# Altium schematic sheet Main.SchDoc
size Legal
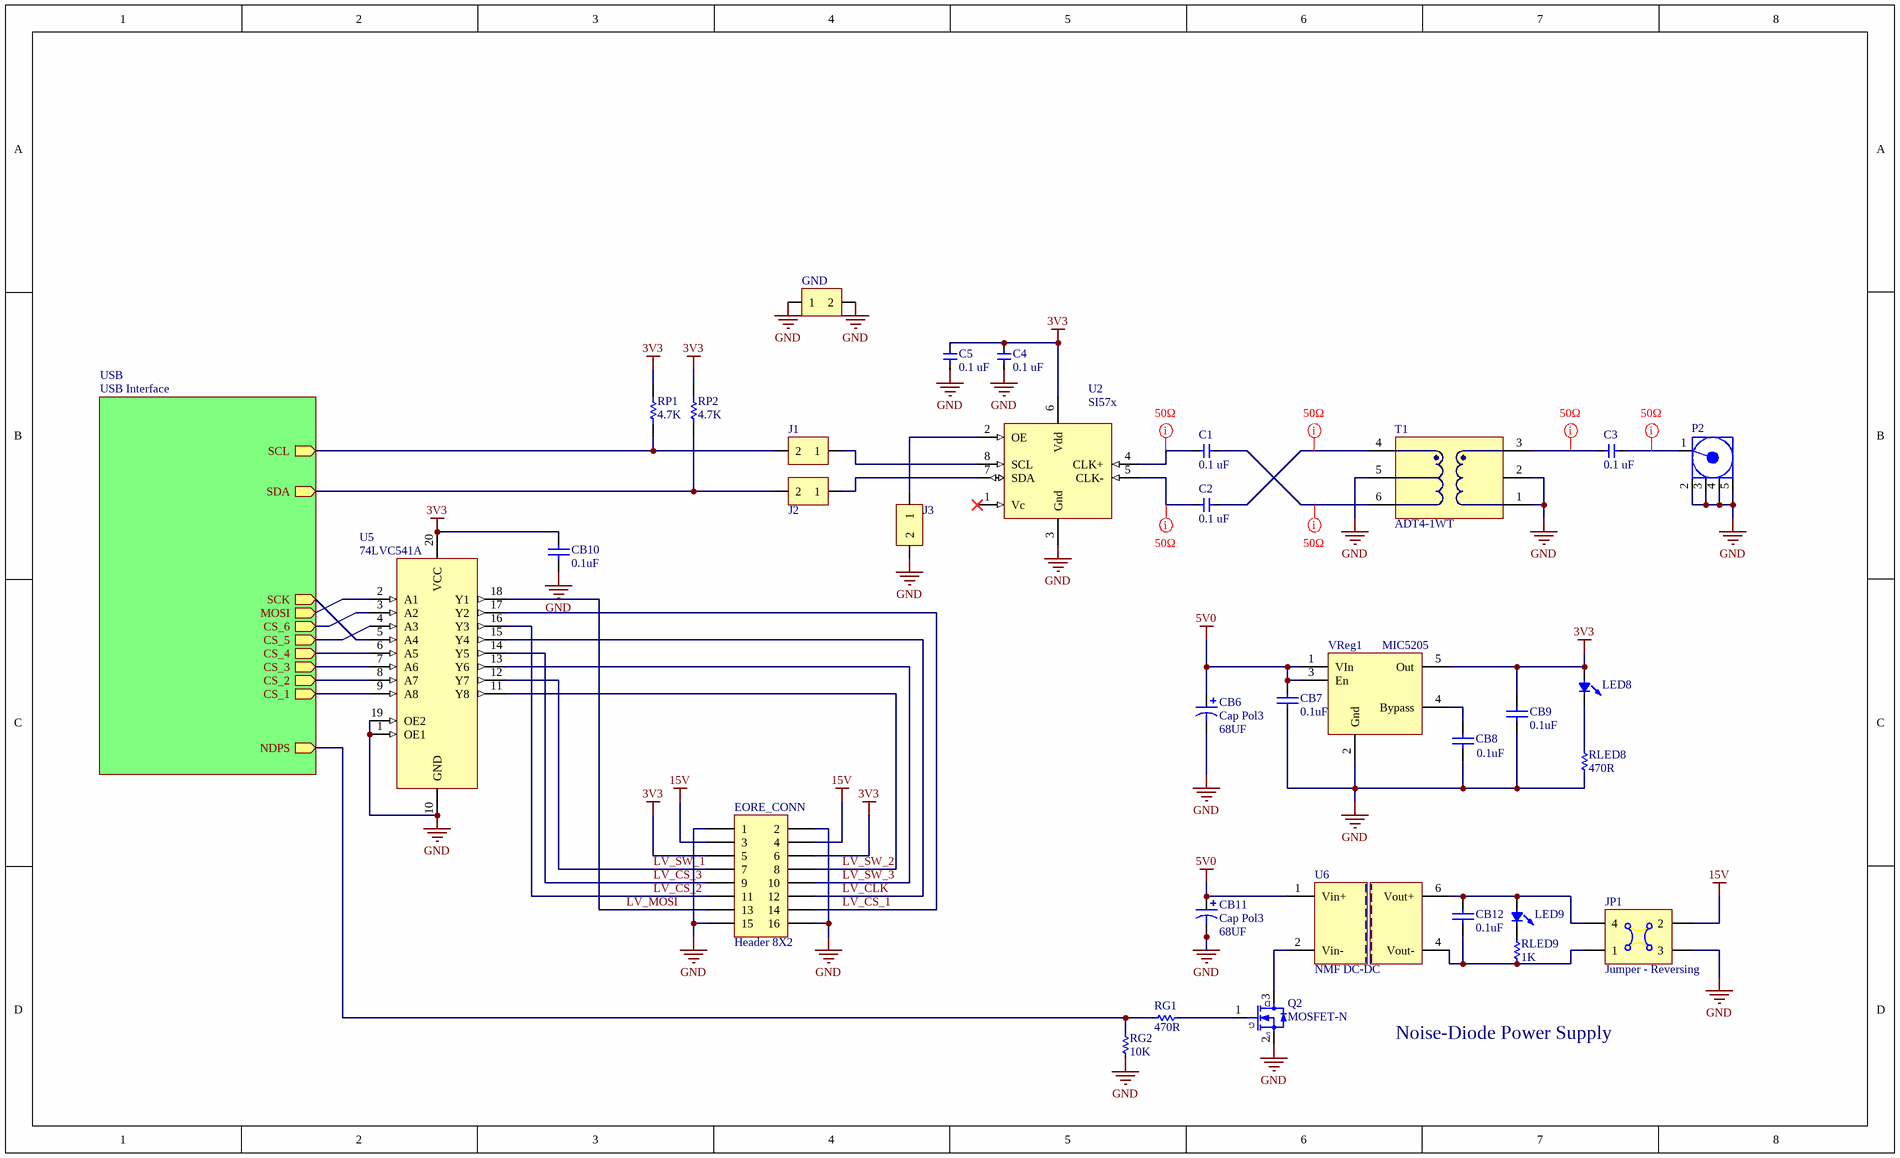
[diagram p0: Main.SchDoc]

## Parts
C1  value 0.1 uF  [0603C]  (hidden comment: SMT Cap)
C2  value 0.1 uF  [0603C]  (hidden comment: SMT Cap)
C3  value 0.1 uF  [0603C]  (hidden comment: SMT Cap)
C4  value 0.1 uF  [0603C]  (hidden comment: SMT Cap)
C5  value 0.1 uF  [0603C]  (hidden comment: SMT Cap)
CB6  Cap Pol3  value 68UF  [V]
CB7  value 0.1uF  [0603C]  (hidden comment: Cap Semi)
CB8  value 0.1uF  [0603C]  (hidden comment: Cap Semi)
CB9  value 0.1uF  [0603C]  (hidden comment: Cap Semi)
CB10  value 0.1uF  [0603C]  (hidden comment: Cap Semi)
CB11  Cap Pol3  value 68UF  [V]
CB12  value 0.1uF  [0603C]  (hidden comment: Cap Semi)
EORE_CONN  Header 8X2  [SMT 16-pin rectangular header]
GND  Jumper  [HDR1X2]  (value not drawn)
J1  Jumper  [HDR1X2]  (value not drawn)
J2  Jumper  [HDR1X2]  (value not drawn)
J3  Jumper  [HDR1X2]  (value not drawn)
JP1  Jumper - Reversing  [HDR2X2]
LED8  LED0  [T1 LED]  (value not drawn)
LED9  LED0  [T1 LED]  (value not drawn)
P2  COAX-M  [SMA Jack - PCB Edge - MultiSize]  (value not drawn)
Q2  MOSFET-N  [SOT23-3N]
RG1  value 470R  [0603R]  (hidden comment: Res Semi Small)
RG2  value 10K  [0603R]  (hidden comment: Res Semi Small)
RLED8  value 470R  [0603R]  (hidden comment: Res Semi Small)
RLED9  value 1K  [0603R]  (hidden comment: Res Semi Small)
RP1  value 4.7K  [0603R]  (hidden comment: Res Semi)
RP2  value 4.7K  [0603R]  (hidden comment: Res Semi)
T1  ADT4-1WT  [CD542]
U2  SI57x  [SI57x]
U5  74LVC541A  [SOP65P780-20AN]
U6  NMF DC-DC  [SIL-6(A1)]
VReg1  MIC5205  [SOT23-5AN]

## Sub-sheets
USB = USB Interface: SCL (out), SDA (out), SCK (out), MOSI (out), CS_1 (out), CS_2 (out), CS_3 (out), CS_4 (out), CS_5 (out), CS_6 (out), NDPS (out)

## Nets
3V3: C4.2 C5.2 CB9.2 CB10.2 EORE_CONN.5 EORE_CONN.6 LED8.1 RP1.2 RP2.2 U2.6(Vdd) U5.20(VCC) VReg1.5(Out)
5V0: CB6.1 CB7.2 CB11.1 U6.1(Vin+) VReg1.1(VIn) VReg1.3(En)
15V: EORE_CONN.3 EORE_CONN.4 JP1.2
GND: C4.1 C5.1 CB6.2 CB7.1 CB8.1 CB9.1 CB10.1 CB11.2 EORE_CONN.1 EORE_CONN.2 EORE_CONN.15 EORE_CONN.16 GND.1 GND.2 J3.2 JP1.3 P2.2(GND) P2.3(GND) P2.4(GND) P2.5(GND) Q2.2(S) RG2.1 RLED8.2 T1.1(Input) T1.2(Gnd) T1.5(Termination) U2.3(Gnd) U5.1(OE1) U5.10(GND) U5.19(OE2) VReg1.2(Gnd)
LV_CLK: EORE_CONN.12 U5.15(Y4)
LV_CS_1: EORE_CONN.14 U5.17(Y2)
LV_CS_2: EORE_CONN.11 U5.16(Y3)
LV_CS_3: EORE_CONN.9 U5.14(Y5)
LV_MOSI: EORE_CONN.13 U5.18(Y1)
LV_SW_1: EORE_CONN.7 U5.12(Y7)
LV_SW_2: EORE_CONN.8 U5.11(Y8)
LV_SW_3: EORE_CONN.10 U5.13(Y6)
NetC1_1: C1.1 U2.4(CLK+)
NetC1_2: C1.2 T1.6(Output)
NetC2_1: C2.1 U2.5(CLK-)
NetC2_2: C2.2 T1.4(Termination)
NetC3_1: C3.1 T1.3(Coupled)
NetC3_2: C3.2 P2.1(Signal)
NetCB8_2: CB8.2 VReg1.4(Bypass)
NetCB12_1: CB12.1 JP1.1 RLED9.2 U6.4(Vout-)
NetCB12_2: CB12.2 JP1.4 LED9.1 U6.6(Vout+)
NetJ1_1: J1.1 U2.8(SCL)
NetJ1_2: J1.2 RP1.1 ; sheet USB/SCL
NetJ2_1: J2.1 U2.7(SDA)
NetJ2_2: J2.2 RP2.1 ; sheet USB/SDA
NetJ3_1: J3.1 U2.2(OE)
NetLED8_2: LED8.2 RLED8.1
NetLED9_2: LED9.2 RLED9.1
NetQ2_1: Q2.1(G) RG1.2
NetQ2_3: Q2.3(D) U6.2(Vin-)
NetRG1_1: RG1.1 RG2.2 ; sheet USB/NDPS
NetU5_2: U5.2(A1) ; sheet USB/MOSI
NetU5_3: U5.3(A2) ; sheet USB/CS_6
NetU5_4: U5.4(A3) ; sheet USB/CS_5
NetU5_5: U5.5(A4) ; sheet USB/SCK
NetU5_6: U5.6(A5) ; sheet USB/CS_4
NetU5_7: U5.7(A6) ; sheet USB/CS_3
NetU5_8: U5.8(A7) ; sheet USB/CS_2
NetU5_9: U5.9(A8) ; sheet USB/CS_1

Not connected (* = marked no-connect by the designer): U2 1(Vc)*

## Layout directives
rule Width Constraint [Pref Impedance = 50.00ohms    Min Impedance = 45.00ohms    Max Impedance = 70.00ohms]: NetC1_1, NetC1_2, NetC2_1, NetC2_2, NetC3_1, NetC3_2

## Notes on the sheet
- Noise-Diode Power Supply

## Library data of the parts
C1-C5 = Cap - SMT Small: Published: 8-Jun-2000; LatestRevisionDate: 29-May-2009; LatestRevisionNote: IPC-7351 Footprint Added.; PackageReference: C1206; Publisher: Altium Limited; PackageDescription: Chip Capacitor
CB6 CB11 = Cap Pol3: KEMET T520 KO-CAP  Polymer SMT Tantalum; DKPN: 399-3330-1-ND; Voltage: 10V; Type: KEMET T520 KO-CAP  Polymer SMT Tantalum
CB7-CB10 CB12 = Cap Semi: Capacitor (Semiconductor SIM Model); Published: 8-Jun-2000; LatestRevisionDate: 17-Jul-2002; LatestRevisionNote: Re-released for DXP Platform.; PackageReference: C1206; Publisher: Altium Limited
EORE_CONN = Header 8X2: Header, 8-Pin, Dual row; LatestRevisionDate: 17-Jul-2002; LatestRevisionNote: Re-released for DXP Platform.; Publisher: Altium Limited
GND J1-J3 = Jumper - 2 Pin: Jumper - 2-Pin; LatestRevisionDate: 17-Jul-2002; LatestRevisionNote: Re-released for DXP Platform.; Publisher: Altium Limited
JP1 = Jumper - Reversing: Reversing Jumper; LatestRevisionDate: 17-Jul-2002; LatestRevisionNote: Re-released for DXP Platform.; Publisher: Altium Limited
LED8 LED9 = LED0: T 1 3/4 LED; Published: 8-Jun-2000; LatestRevisionDate: 08-Jul-2005; LatestRevisionNote: Mech Layer 1 removed.; PackageReference: LED-0; Publisher: Altium Limited
P2 = COAX-M: RF Coaxial PCB Connector, MMCX; Thru-Hole, Vertical Mount Plug,  50 Ohm Impedance; PackageDocument: Rev. A, 16-Jun-1997; PCB_Layout: Complies with manufacturer's recommendation.; DrillSize: Corresponds to nominal value.; Published: 15-Jul-2004; LatestRevisionDate: 15-Jul-2004; LatestRevisionNote: Component Replaced.; DatasheetDocument: 30-May-2003; PackageReference: 908-21103; Publisher: Altium Limited; ComponentLink1Description: Manufacturer Link; ComponentLink1URL: http://www.amphenolrf.com/
Q2 = MOSFET-N: N-Channel MOSFET; Published: 8-Jun-2000; LatestRevisionDate: 17-Jul-2002; LatestRevisionNote: Re-released for DXP Platform.; PackageVersion: 1995/1996; PackageReference: E3; Publisher: Altium Limited
RG1 RG2 RLED8 RLED9 = Res Semi Small: Semiconductor Resistor; Published: 8-Jun-2000; LatestRevisionDate: 17-Jul-2002; LatestRevisionNote: Re-released for DXP Platform.; PackageReference: AXIAL-0.5; Publisher: Altium Limited
RP1 RP2 = Res Semi: Semiconductor Resistor; Published: 8-Jun-2000; LatestRevisionDate: 17-Jul-2002; LatestRevisionNote: Re-released for DXP Platform.; PackageReference: AXIAL-0.5; Publisher: Altium Limited
T1 = ADT4-1WT: Surface Mount RF Transformer
U2 = SI570: 10 MHZ TO 1.4 GHZ I2C PROGRAMMABLE XO/VCXO
U5 = 74LVC541A: Octal buffer/line driver with 5 V tolerant inputs/outputs; 3-state
U6 = Murata NMF DC-DC: Murata NMF DC-DC - 1W, Single output
VReg1 = MIC5205: 150mA Low-Noise LDO Regulator